# Altium project template.PrjPcb
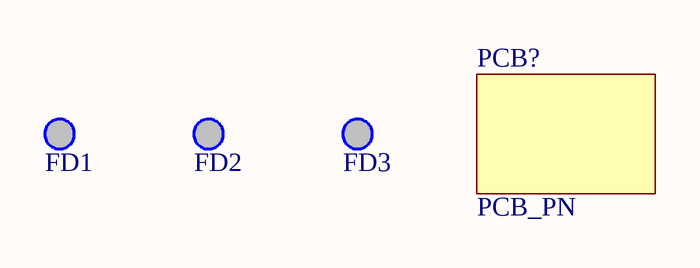
[diagram p0: template.SchDoc]
AddressLine1: 728 Watermark Ct.; AddressLine2: Neenah, WI 54956; Country: USA; Designer: First Last; Division: Global Rolls Technology; Initials: JWS; LayoutTitle: BoardName; Org: ANDRITZ Fabrics and Rolls; PCBRev: v0.0; ProjectTitle: ProjName; SchRev: v0.0
1 sheet, 4 parts. Net scope: global (net labels, ports and power ports of the same name join across sheets).
Board file: template.PcbDoc

## Sheet template.SchDoc
size 419 x 266 mm

### Parts
FD1  FID  [FID_50MIL]  (value not drawn)  (no BOM)
FD2  FID  [FID_50MIL]  (value not drawn)  (no BOM)
FD3  FID  [FID_50MIL]  (value not drawn)  (no BOM)
PCB?  PCB_PN  (mechanical)

### Notes on the sheet
- 1
- 2
- 3
- 4
- 5
- 6
- 7
- 8
- A
- B
- C
- D
- E
- F
- Title:
- Project:
- Designer:
- Valence Engineering LLC
- Size:
- Revision:
- Date:
- Sheet:
- of

### Library data of the parts
FD1-FD3 = FID: Fiducial, Generic
PCB? = PCB_PN: BARE PCB FOR PROJ NAME; MFR1: *; MPN1: *; MPN2: PCBPN0.0; MFR2: ANDRITZ